# EAGLE schematic Schematic (EAGLE 6.6.0)
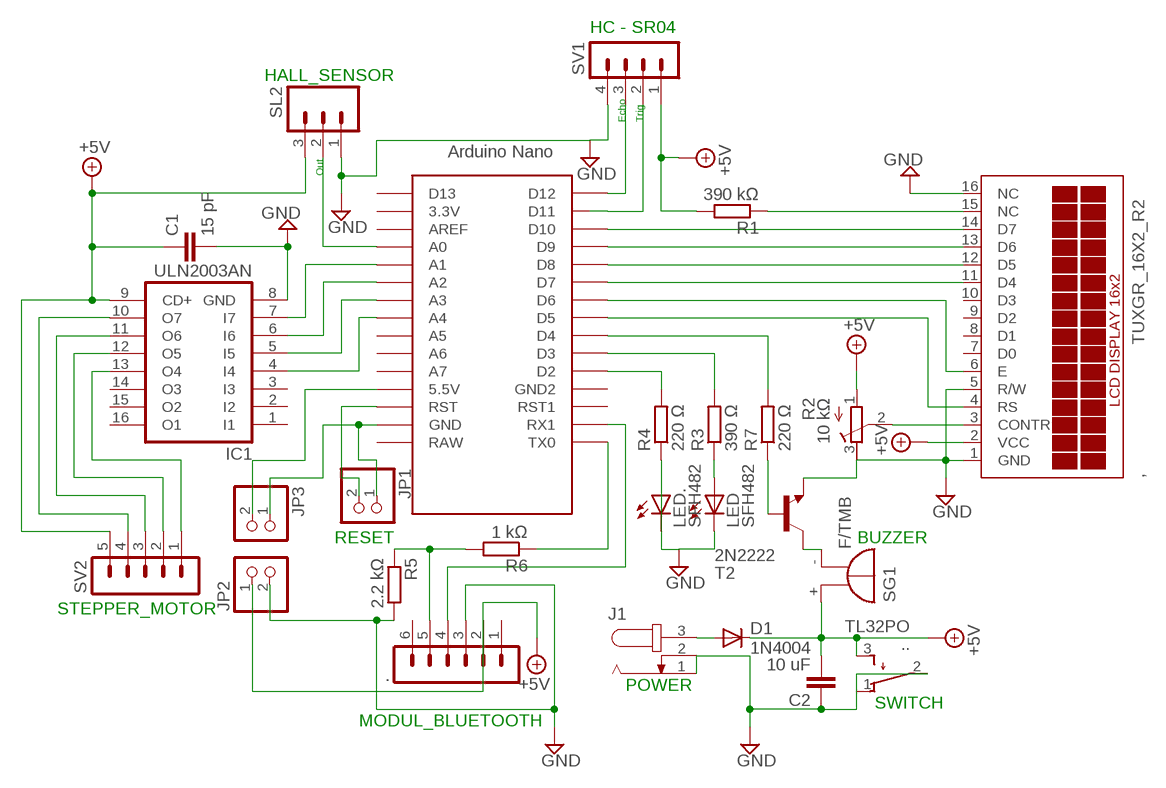
[diagram p0: schematic, sheet 1]

## Parts
,  TUXGR_16X2_R2  [TUXGR_16X2_R2]
.  MA06-1  [MA06-1]
..  TL32PO  [TL3XPO]
C1  15 pF  C-EU025-024X044  [C025-024X044]
C2  10 uF  C-EU025-024X044  [C025-024X044]
D1  1N4004  [DO41-10]
IC1  ULN2003AN  [DIL16]
J1  JACK-PLUG0  [SPC4077]
JP1  PINHD-1X2  [1X02]
JP2  PINHD-1X2  [1X02]
JP3  PINHD-1X2  [1X02]
LED  SFH482  [SFH482]
LED.  SFH482  [SFH482]
R1  390 kΩ  R-EU_0207/10  [0207/10]
R2  10 kΩ  R-TRIMM3339P  [RTRIM3339P]
R3  390 Ω  R-EU_0207/10  [0207/10]
R4  220 Ω  R-EU_0207/10  [0207/10]
R5  2.2 kΩ  R-EU_0207/10  [0207/10]
R6  1 kΩ  R-EU_0207/10  [0207/10]
R7  220 Ω  R-EU_0207/10  [0207/10]
SG1  F/TMB  [F/TMB]
SL2  MA03  [03P]
SV1  MA04-1  [MA04-1]
SV2  MA05-1  [MA05-1]
T2  2N2222  [TO92-EBC-OVAL]
U$2  NANO  [NANO]

## Nets
+5V: ,.2(VCC) ..2 ...3(S) C1.1 C2.2 D1.C IC1.9(CD+) JP2.1 R1.2 R2.1(E) SG1.+ SL2.3 SV1.1 SV2.5
GND: ,.1(GND) ,.5(R/W) ,.16(NC) ..3 ...1(O) ...2(P) C1.2 C2.1 IC1.8(GND) J1.1 J1.2 JP2.2 LED..A LED..K(C) LED.K(C) R2.3(A) R4.1 R5.2 SL2.1 SV1.4 T2.E
N$1: ,.3(CONTR) R2.2(S)
N$2: ,.15(NC) R1.1
N$3: R4.2 U$2.D2
N$4: R3.2 U$2.D3
N$5: LED.A R3.1
N$6: R7.2 U$2.D4
N$7: R7.1 T2.B
N$8: IC1.7(I7) U$2.A1
N$9: IC1.6(I6) U$2.A2
N$10: ,.14(D7) U$2.D10
N$11: ,.13(D6) U$2.D9
N$12: SV1.2 U$2.D11
N$13: SV1.3 U$2.D12
N$14: IC1.5(I5) U$2.A3
N$15: IC1.4(I4) U$2.A4
N$16: ,.12(D5) U$2.D8
N$17: IC1.13(O4) SV2.1
N$18: IC1.12(O5) SV2.2
N$19: IC1.11(O6) SV2.3
N$20: IC1.10(O7) SV2.4
N$21: JP1.1 JP3.1 U$2.GND
N$22: ,.11(D4) U$2.D7
N$23: JP1.2 U$2.RST
N$26: SG1.- T2.C
N$27: ,.6(E) U$2.D6
N$28: SL2.2 U$2.A0
N$29: ,.4(RS) U$2.D5
N$32: R6.1 U$2.TX0
N$33: ..5 R5.1 R6.2
N$34: ..4 U$2.RX1
N$36: JP3.2 U$2.5V(5.5V)
N$37: D1.A J1.3
Unconnected: ,.7(D0) ,.8(D1) ,.9(D2) ,.10(D3) ..1 ..6 IC1.1(I1) IC1.2(I2) IC1.3(I3) IC1.14(O3) IC1.15(O2) IC1.16(O1) U$2.3.3V U$2.A5 U$2.A6 U$2.A7 U$2.AREF U$2.D13 U$2.GND1(GND2) U$2.RAW U$2.RST1

## Notes on the sheet
- HC - SR04
- HALL_SENSOR
- Echo | Trig
- Out
- RESET | BUZZER
- STEPPER_MOTOR
- POWER
- SWITCH
- MODUL_BLUETOOTH

## Library data of the parts
, = display-lcd:TUXGR_16X2_R2: Tuxgraphics LCD display 16x2 characters reflective, without background light Source: tuxgr_12x2_r2.pdf; OC_FARNELL: unknown; OC_NEWARK: unknown
. = con-lstb:MA06-1: PIN HEADER; OC_FARNELL: unknown; OC_NEWARK: unknown
.. = switch:TL32PO: TINY SWITCH ON - MOM Source: http://www2.produktinfo.conrad.com/datenblaetter/700000-724999/705152-da-01-de-Subminiaturschalter_TL_36YO.pdf
C1 C2 = rcl:C-EU: CAPACITOR, European symbol
D1 = diode:1N4004: DIODE general purpose rectifier, 1 A
IC1 = uln-udn:ULN2003A: DRIVER ARRAY
J1 = con-jack:JACK-PLUG: DC POWER JACK Power Jack, DC, Right Angle, Through Hole, Rated 5A at 16VDC, PC Terminals Distributor: Farnell (www.Farnell.de) Drawing: 84N1161.pdf / 84N1162.pdf Manufacturer: SPC Technology (www.spctechnology.com) Type: SPC4077 / SPC 4078; OC_FARNELL: unknown; OC_NEWARK: unknown
JP1-JP3 = pinhead:PINHD-1X2: PIN HEADER
LED LED. = led:SFH482: IR LED infrared emitting diode, Infineon
R1 R3-R7 = resistor:R-EU_: RESISTOR, European symbol
R2 = resistor:R-TRIMM: Trimm resistor
SG1 = buzzer:F/TMB: BUZZER Source: Buerklin; OC_FARNELL: unknown; OC_NEWARK: unknown
SL2 = con-amp-quick:MA03: AMP QUICK CONNECTOR; OC_FARNELL: unknown; OC_NEWARK: unknown
SV1 = con-lstb:MA04-1: PIN HEADER; OC_FARNELL: unknown; OC_NEWARK: unknown
SV2 = con-lstb:MA05-1: PIN HEADER; OC_FARNELL: unknown; OC_NEWARK: unknown
T2 = adafruit:2N2222: NPN TRANSISTOR Big oval pads
U$2 = Arduino-clone:NANO: Arduino Nano